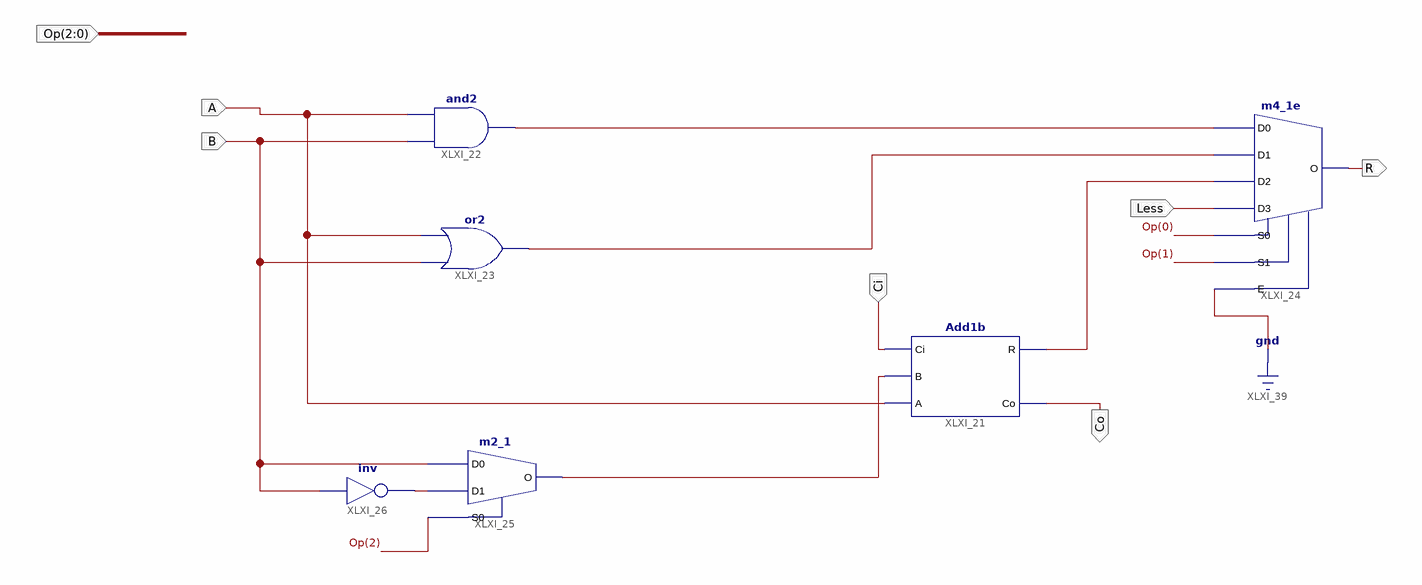
[diagram p0: schematic sheet 1]
// Xilinx ISE schematic ALU1b.sch (spartan3e) as structural Verilog: 6 symbols, 7 ports
module ALU1b (
  input  B,
  input  A,
  input  Ci,
  input  [2:0] Op,
  input  Less,
  output Co,
  output R
);

  wire XLXN_45, XLXN_46, XLXN_47, XLXN_53, XLXN_55;

  and XLXI_22 (XLXN_46, B, A);
  or XLXI_23 (XLXN_47, B, A);
  m4_1e XLXI_24 (.D0(XLXN_46), .D1(XLXN_47), .D2(XLXN_45), .D3(Less), .E(1'b0), .S0(Op[0]), .S1(Op[1]), .O(R));
  Add1b XLXI_21 (.Ci(Ci), .B(XLXN_53), .A(A), .R(XLXN_45), .Co(Co));
  m2_1 XLXI_25 (.D0(B), .D1(XLXN_55), .S0(Op[2]), .O(XLXN_53));
  not XLXI_26 (XLXN_55, B);
endmodule
